# EAGLE design ps (EAGLE 6.5.0)
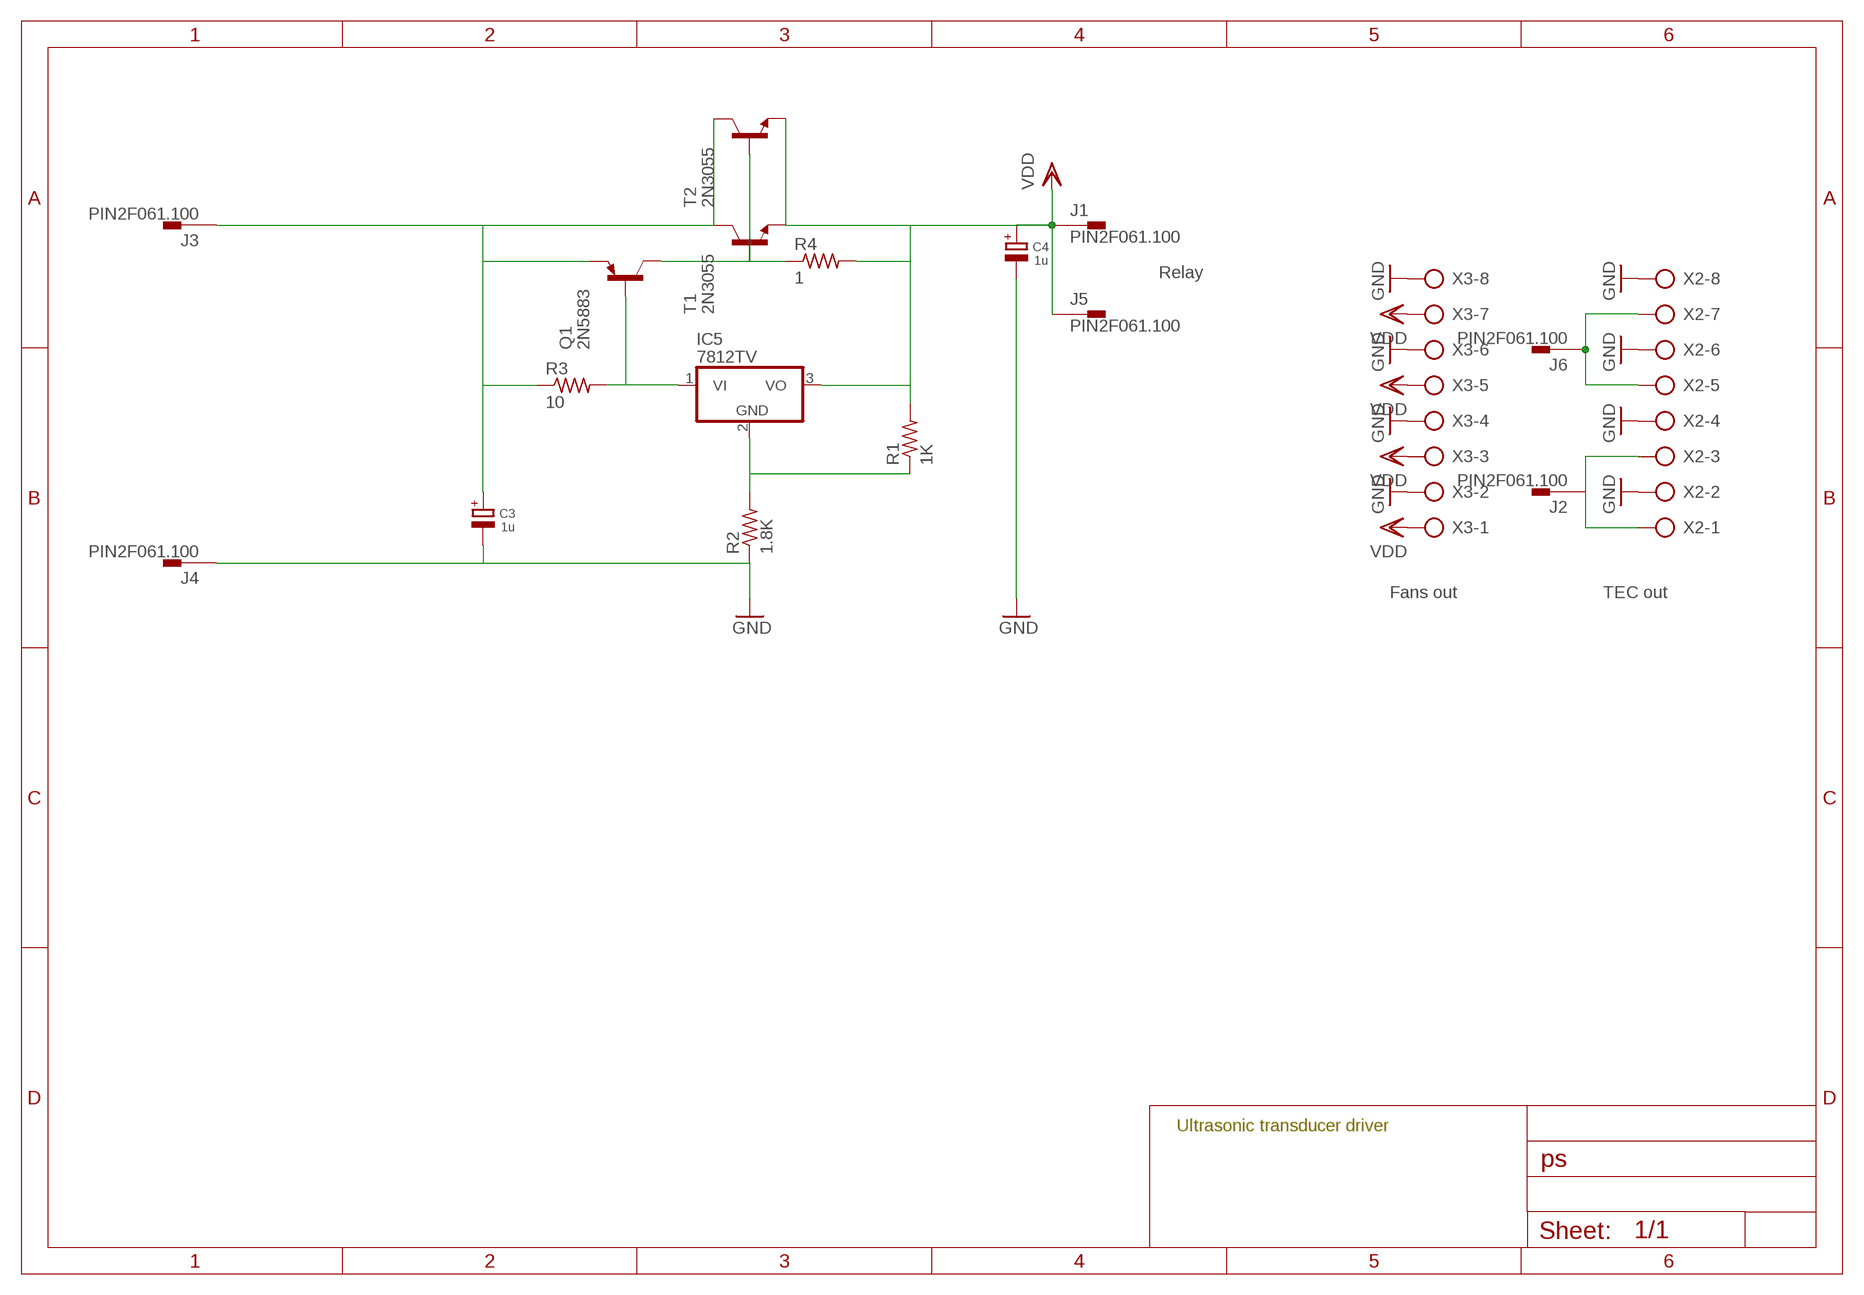
[diagram p0: schematic, sheet 1]

## Parts
C3  1u  CPOL-EUE10-20  [EB20D]
C4  1u  CPOL-EUE10-20  [EB20D]
IC5  7812TV  [TO220V]
J1  PIN2F061.100  [F061.100]
J2  PIN2F061.100  [F061.100]
J3  PIN2F061.100  [F061.100]
J4  PIN2F061.100  [F061.100]
J5  PIN2F061.100  [F061.100]
J6  PIN2F061.100  [F061.100]
Q1  2N5883  2N4905  [TO3]
R1  1K  R-US_0207/15  [0207/15]
R2  1.8K  R-US_0207/15  [0207/15]
R3  10  R-US_0207/15  [0207/15]
R4  1  R-US_0922/22  [0922/22]
T1  2N3055  [TO3]
T2  2N3055  [TO3]
X2  AK300/8  [AK300/8]
X3  AK300/8  [AK300/8]

## Nets
GND: C3.- C4.- J4.A1 J4.A2 R2.1 X2.2 X2.4 X2.6 X2.8 X3.2 X3.4 X3.6 X3.8
N$1: Q1.C Q1.C/(C) R4.1 T1.B T2.B
N$4: IC5.1(VI) Q1.B R3.2
N$5: IC5.2(GND) R1.1 R2.2
TEC1: J2.A1 J2.A2 X2.1 X2.3
TEC2: J6.A1 J6.A2 X2.5 X2.7
VDD: C4.+ IC5.3(VO) J1.A1 J1.A2 J5.A1 J5.A2 R1.2 R4.2 T1.E T2.E X3.1 X3.3 X3.5 X3.7
VIN: C3.+ J3.A1 J3.A2 Q1.E R3.1 T1.C T1.C/(C) T2.C T2.C/(C)

## Notes on the sheet
- Relay
- Fans out | TEC out
- Ultrasonic transducer driver

## Library data of the parts
C3 C4 = rcl:CPOL-EU: POLARIZED CAPACITOR, European symbol
IC5 = linear:78*: Positive VOLTAGE REGULATOR Source: http://cache.national.com/ds/LM/LM78L05.pdf http://www.fairchildsemi.com/ds/LM/LM7805.pdf
J1-J6 = con-faston:PIN2: Flachstecker Typ Tyco/Electronics/AMP TAB, FASTON Printed Circuit Board Tabs Source: http://www.buerklin.com, http://catalog.tycoelectronics.com; OC_FARNELL: unknown; OC_NEWARK: unknown
Q1 = transistor-pnp:2N4905: PNP Transistor
R1-R4 = rcl:R-US_: RESISTOR, American symbol
T1 T2 = transistor:2N3055: NPN TRANSISTOR
X2 X3 = con-ptr500:AK300/8: CONNECTOR; OC_FARNELL: unknown; OC_NEWARK: unknown

## Board
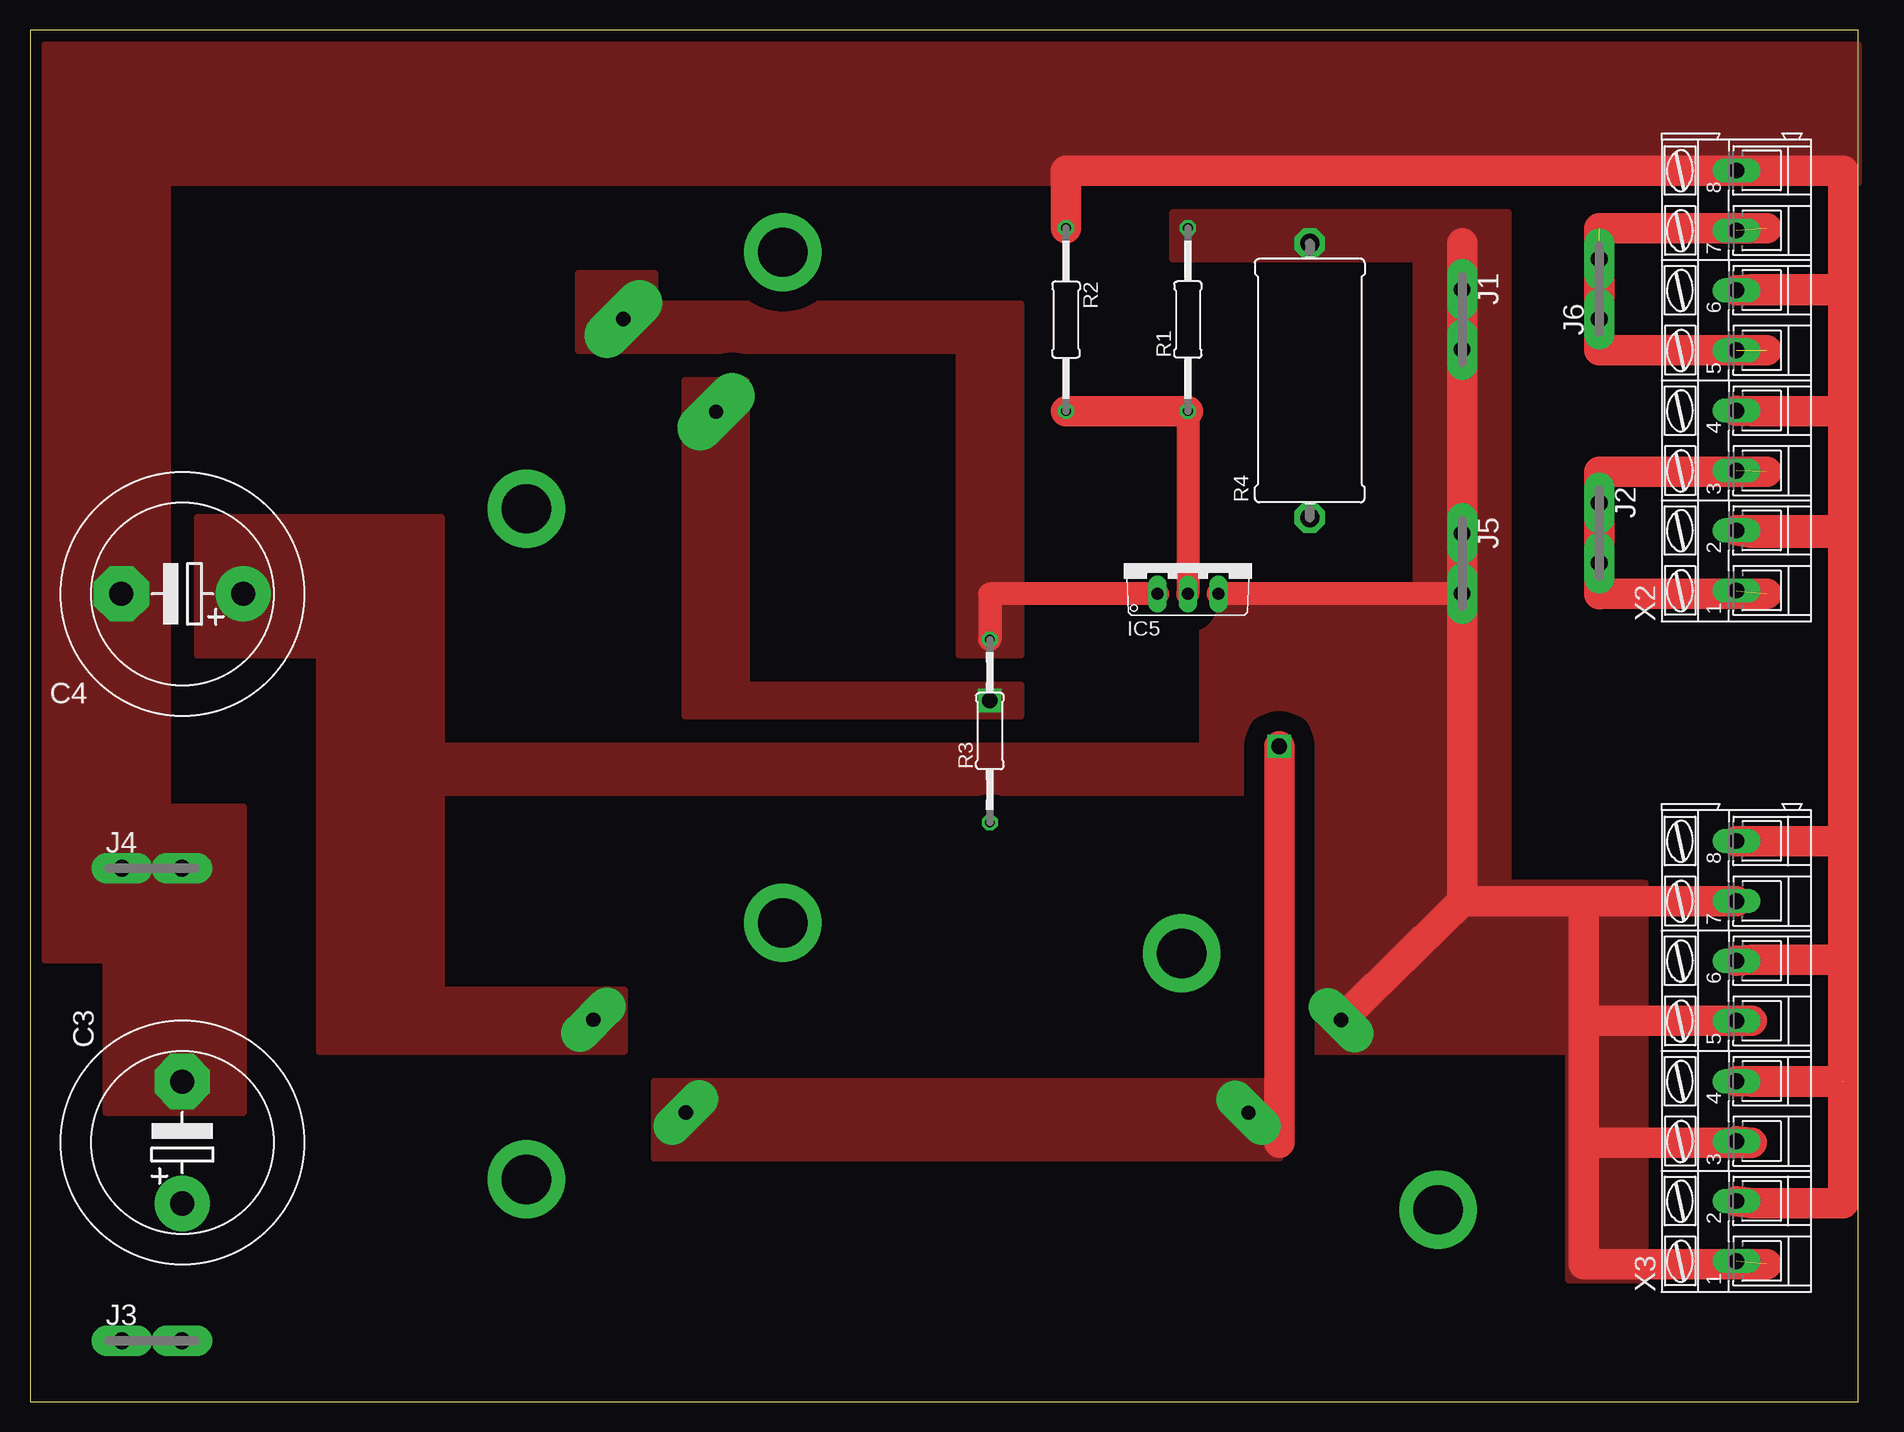
[diagram p1: board, top side]
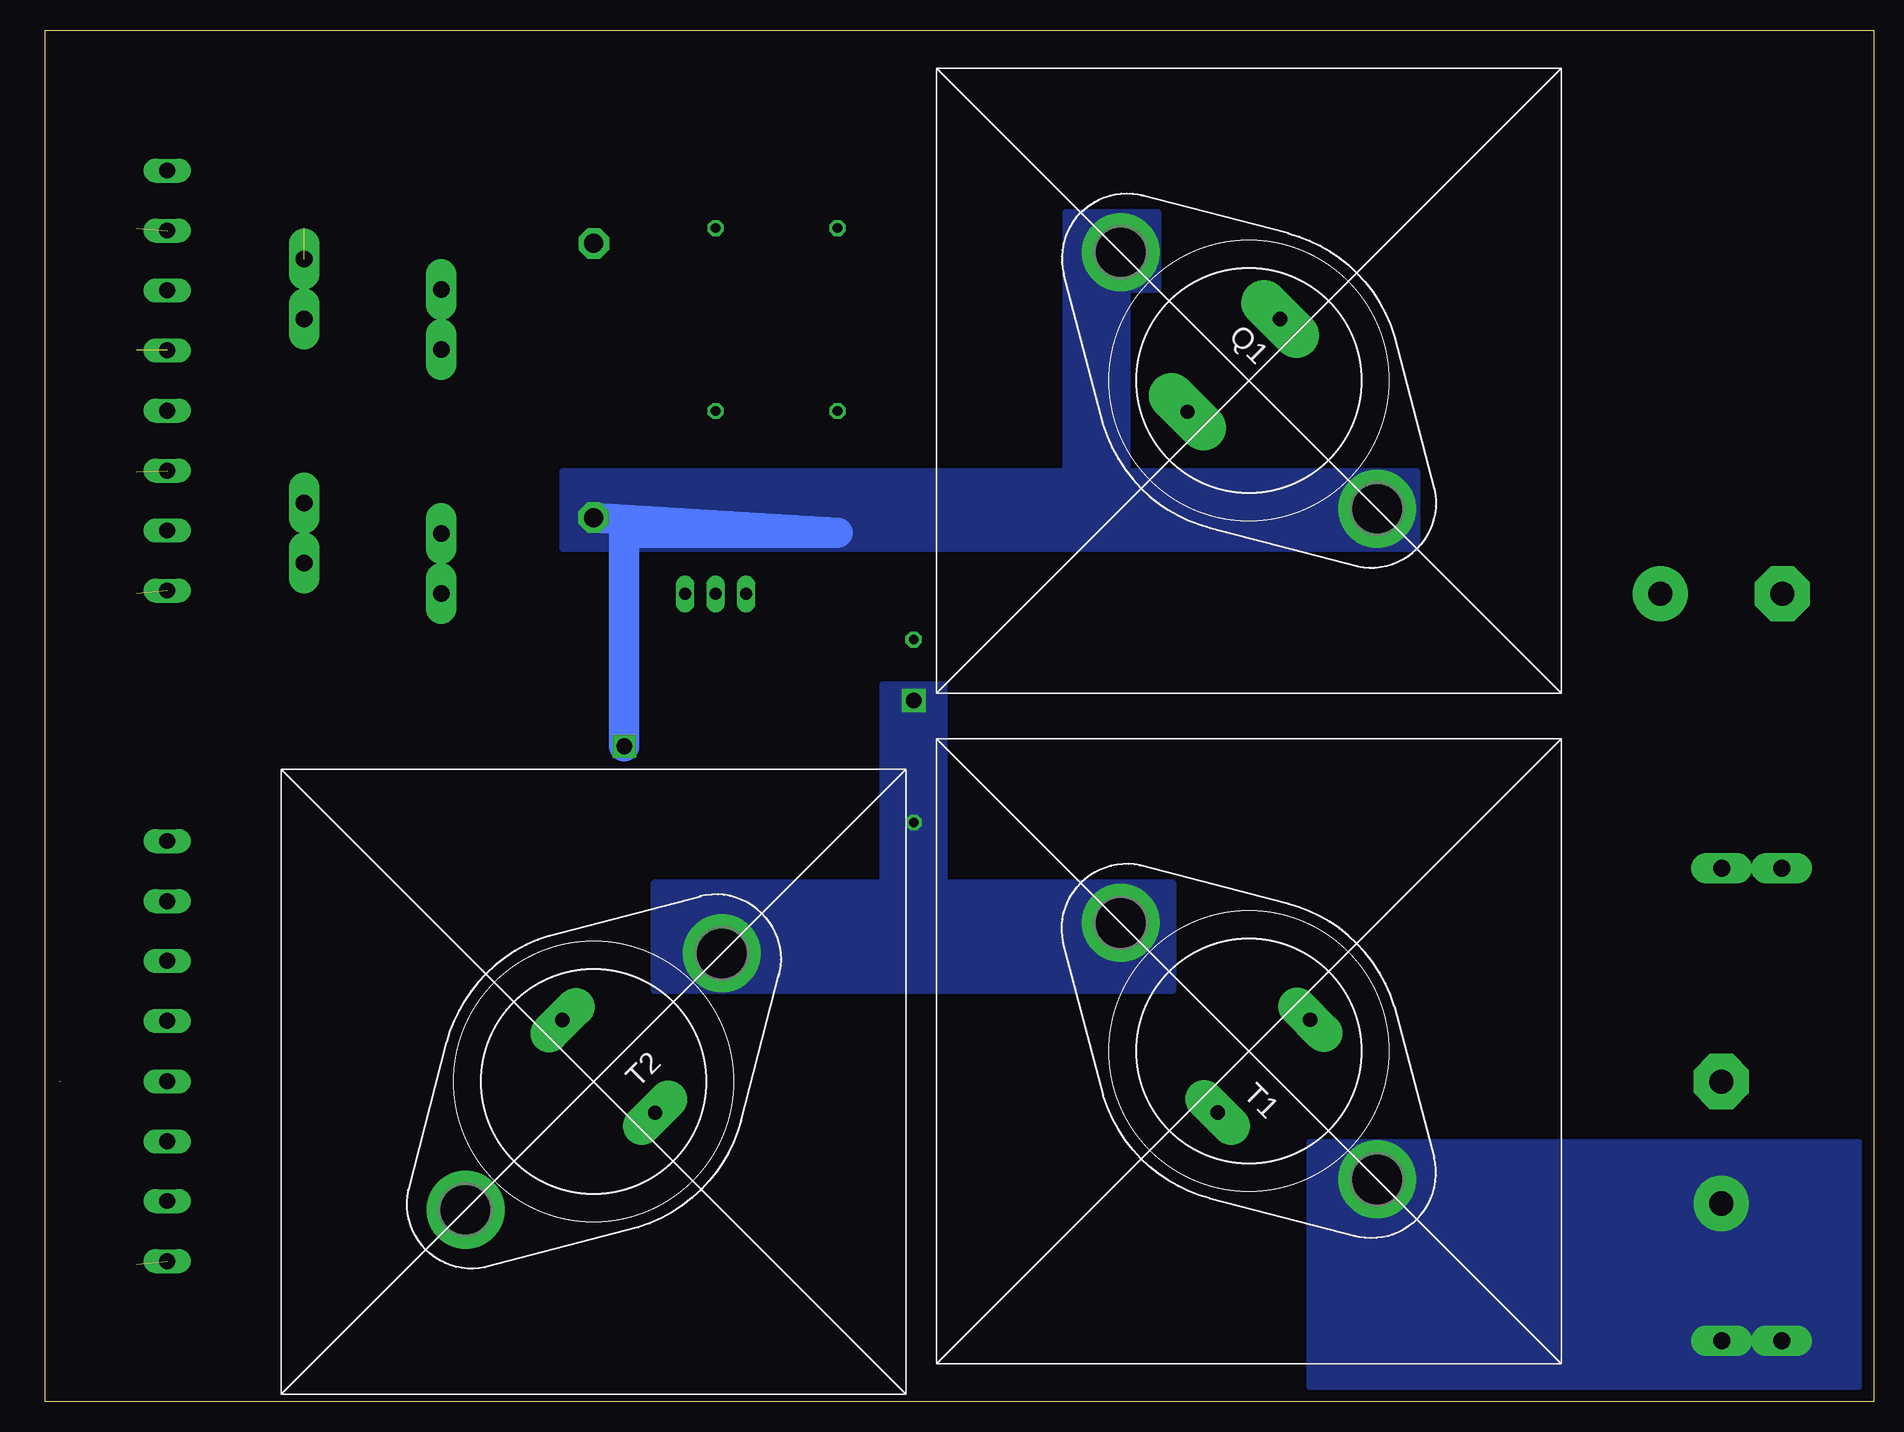
[diagram p2: board, bottom side, seen from below]

Size 152.4 x 114.3 mm. Coordinates in mm from the lower left corner, seen from the top.
Outline: 0,0 152.4,0 152.4,114.3 0,114.3 0,0
Copper layers (1*16): Top 0.035mm / dielectric 1.5mm / Bottom 0.035mm
Design rules "default *": minimum track width 10mil, minimum drill 24mil, track to track 8mil, track to pad 8mil, pad to pad 8mil, via to via 8mil, smd to smd 8mil, copper to edge 0mil, drill to drill 8mil, minimum pad ring 10mil, minimum via ring 8mil, stop-mask expansion 4mil, vias tented up to drill 0mil, thermal gap 10mil

### Footprints (pad centres in the part's own frame; a part is rotated, then mirrored left to right if it is on the bottom)
EB20D = drill 2.007 pad 4.597: + -5.08,0 | drill 2.007 pad 4.597 octagon: - 5.08,0
TO220V = drill 1.016 long: 1 -2.54,-2.54; 2 0,-2.54; 3 2.54,-2.54
F061.100 = drill 1.4 pad 2.54 long: A1 -2.5,0; A2 2.5,0
TO3 = drill 1.194 pad 3.81 long: B -1.778,5.461; E -1.778,-5.461 | drill 4.115 pad 6.477: C 15.113,0; C/ -15.113,0
0207/15 = drill 0.813 octagon: 1 -7.62,0; 2 7.62,0
0922/22 = drill 1.6 pad 2.54 octagon: 1 -11.43,0; 2 11.43,0
TO3' = drill 1.194 pad 3.15 long: B -1.778,5.461; E -1.778,-5.461 | drill 4.115 pad 6.477: C 15.113,0; C/ -15.113,0
AK300/8 = drill 1.321 long: 1 -17.501,0; 2 -12.497,0; 3 -7.518,0; 4 -2.515,0; 5 2.515,0; 6 7.518,0; 7 12.497,0; 8 17.501,0

### Placement (x,y rotation side)
C3  12.7,21.59 90 top
C4  12.7,67.31 180 top
IC5  96.52,69.85 0 top
J1  119.38,90.17 270 top
J2  130.81,72.39 270 top
J3  10.16,5.08 0 top
J4  10.16,44.45 0 top
J5  119.38,69.85 270 top
J6  130.81,92.71 90 top
Q1  52.07,85.09 315 bottom
R1  96.52,90.17 90 top
R2  86.36,90.17 270 top
R3  80.01,55.88 90 top
R4  106.68,85.09 90 top
T1  2N3055  [TO3']  52.07,29.21 135 bottom
T2  2N3055  [TO3']  106.68,26.67 225 bottom
X2  142.24,85.09 90 top
X3  142.24,29.21 90 top

### Tracks (layer width: path | path; a pad name or v marks a point on that pad's centre or on a via)
GND  (1 unrouted)
  Top 2.54: 151.13,46.71 151.13,36.83 | 151.13,36.83 143.51,36.83 X3.6 | X3.2 143.51,16.51 151.13,16.51 151.13,26.7 X3.4 | X3.8 151.13,46.71 | 151.13,36.83 151.13,26.67 143.51,26.67 | 151.13,82.55 151.13,92.61 X2.6 143.51,92.71 151.13,92.71 151.13,102.59 X2.8 86.36,102.59 R2.1 | X2.4 143.51,82.55 151.13,82.55 | 151.13,82.55 151.13,72.39 143.51,72.39 X2.2 151.13,72.59 151.13,46.71
  pour Top (no thermals): 1.27,73.66 11.43,73.66 11.43,49.53 17.78,49.53 17.78,24.13 6.35,24.13 6.35,36.83 1.27,36.83
  pour Top (no thermals): 1.27,62.23 1.27,113.03 152.4,113.03 152.4,101.6 11.43,101.6 11.43,62.23
N$1  (via drill 1.3)
  Top 2.54: v104.14,54.61 104.14,21.59
  Bottom 2.54: R4.1 86.36,72.39 104.14,72.39 v104.14,54.61
  pour Bottom (no thermals): 59.69,99.06 59.69,92.71 62.23,92.71 62.23,77.47 38.1,77.47 38.1,71.12 109.22,71.12 109.22,77.47 67.31,77.47 67.31,99.06
  pour Top (no thermals): 52.07,26.67 52.07,20.32 104.14,20.32 104.14,26.67
N$4
  Top 1.93: IC5.1 80.01,67.31 R3.2
  pour Top (isolate 1.676, no thermals): 45.72,93.98 45.72,87.63 77.47,87.63 77.47,62.23 82.55,62.23 82.55,91.44 52.07,91.44 52.07,93.98
N$5
  Top 1.93: R1.1 IC5.2
  Top 2.54: R2.2 R1.1
TEC1  (2 unrouted)
  Top 2.54: J2.A2 J2.A1 130.81,67.27 138.43,67.31 | 138.43,67.31 144.78,67.31 | 138.43,67.31 130.81,67.31 130.81,77.47 144.78,77.47
TEC2  (3 unrouted)
  Top 2.54: 144.78,97.79 130.81,97.79 J6.A1 130.81,87.63 144.78,87.63
VDD  (1 unrouted)
  Top 1.93: IC5.3 99.06,67.35 J5.A2
  Top 2.54: X3.7 129.54,41.71 | 129.54,41.71 129.54,31.75 143.51,31.75 X3.5 129.54,31.73 129.54,21.59 | X3.3 143.51,21.59 129.54,21.59 | 129.54,21.59 129.54,11.43 144.78,11.43 | 119.38,96.52 J1.A1 J5.A1 J5.A2 119.38,41.71 | 119.38,41.71 129.54,41.71 | 119.38,41.71 T2.E
  pour Top (no thermals): 13.97,73.66 13.97,62.23 24.13,62.23 24.13,29.21 49.53,29.21 49.53,34.29 34.29,34.29 34.29,73.66
  pour Top (isolate 1.676, no thermals): 134.62,10.16 128.27,10.16 128.27,29.21 106.68,29.21 106.68,50.8 26.67,50.8 26.67,54.61 97.79,54.61 97.79,67.31 120.65,67.31 120.65,43.18 134.62,43.18
  pour Top (no thermals): 115.57,97.79 123.19,97.79 123.19,43.18 115.57,43.18
  pour Top (no thermals): 123.19,99.06 95.25,99.06 95.25,95.25 123.19,95.25
VIN  (via drill 1.3)
  other vias: 80.01,58.42
  pour Bottom (no thermals): 1.27,1.27 46.99,1.27 46.99,21.59 1.27,21.59
  pour Bottom (isolate 1.676, no thermals): 101.6,43.18 58.42,43.18 58.42,34.29 101.6,34.29
  pour Bottom (no thermals): 77.47,59.69 77.47,35.56 82.55,35.56 82.55,59.69
  pour Top (isolate 1.676, no thermals): 82.55,59.69 82.55,57.15 54.61,57.15 54.61,85.09 59.69,85.09 59.69,59.69